# EAGLE design Domino I2S (EAGLE 6.5.0)
DATABASE: ./../Common/BOM/Domino_DB.txt; DRAWN: M.STEMPIN; REV: B
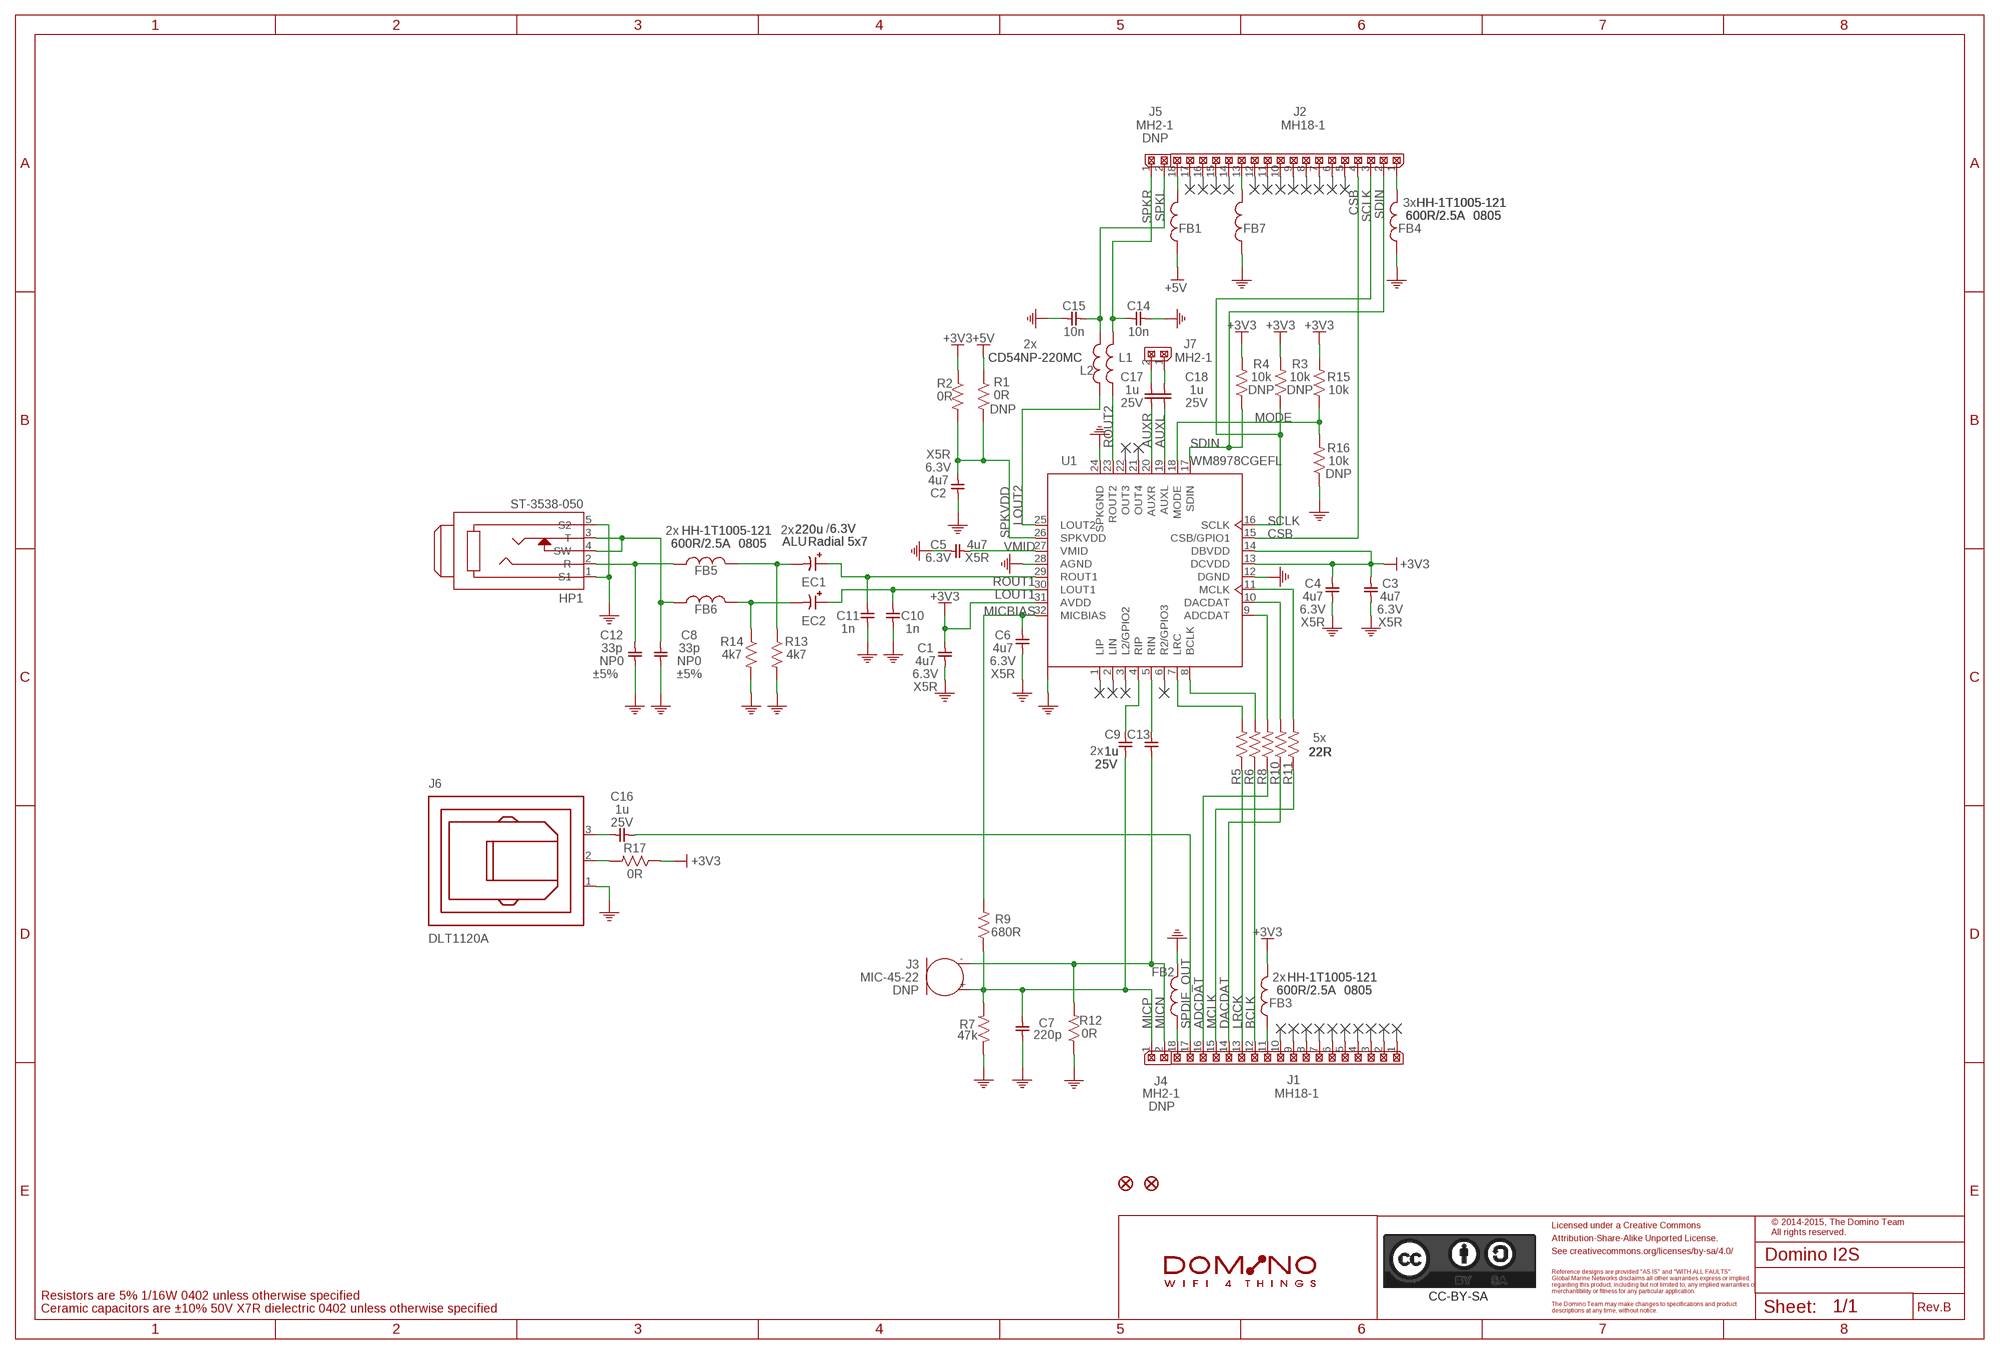
[diagram p0: schematic, sheet 1]
PORT1 (NC): BOM: EXCLUDE
PORT2 (NC): BOM: EXCLUDE
PORT3 (NC): BOM: EXCLUDE
PORT4 (NC): BOM: EXCLUDE
PORT5 (NC): BOM: EXCLUDE
PORT6 (NC): BOM: EXCLUDE
PORT7 (NC): BOM: EXCLUDE
PORT8 (NC): BOM: EXCLUDE
PORT9 (NC): BOM: EXCLUDE
PORT10 (NC): BOM: EXCLUDE
PORT11 (NC): BOM: EXCLUDE
PORT12 (NC): BOM: EXCLUDE
PORT13 (NC): BOM: EXCLUDE
PORT14 (NC): BOM: EXCLUDE
PORT15 (NC): BOM: EXCLUDE
PORT16 (NC): BOM: EXCLUDE
PORT17 (NC): BOM: EXCLUDE
PORT18 (NC): BOM: EXCLUDE
PORT19 (NC): BOM: EXCLUDE
PORT22 (NC): BOM: EXCLUDE
PORT23 (NC): BOM: EXCLUDE
PORT24 (NC): BOM: EXCLUDE
PORT25 (NC): BOM: EXCLUDE
PORT26 (NC): BOM: EXCLUDE
PORT27 (NC): BOM: EXCLUDE
PORT28 (NC): BOM: EXCLUDE
PORT29 (NC): BOM: EXCLUDE
PORT30 (NC): BOM: EXCLUDE

## Parts
C1  4u7  CAP_0402  [C0402]
C2  4u7  CAP_0402  [C0402]
C3  4u7  CAP_0402  [C0402]
C4  4u7  CAP_0402  [C0402]
C5  4u7  CAP_0402  [C0402]
C6  4u7  CAP_0402  [C0402]
C7  220p  CAP_0402  [C0402]
C8  33p  CAP_0402  [C0402]
C9  1u  CAP_0402  [C0402]
C10  1n  CAP_0402  [C0402]
C11  1n  CAP_0402  [C0402]
C12  33p  CAP_0402  [C0402]
C13  1u  CAP_0402  [C0402]
C14  10n  CAP_0402  [C0402]
C15  10n  CAP_0402  [C0402]
C16  1u  CAP_0402  [C0402]
C17  1u  CAP_0402  [C0402]
C18  1u  CAP_0402  [C0402]
CC-BY-SA101  CC-BY-SA_LOGO  [CC-BY-SA_LOGO]
EC1  220u  CPOL_E2-5X7  [E2-5]
EC2  220u  CPOL_E2-5X7  [E2-5]
F1  FIDUCIAL  [FIDUCIAL]
F2  FIDUCIAL  [FIDUCIAL]
FB1  HH-1T1005-121  FB_0805  [FB0805]
FB2  HH-1T1005-121  FB_0805  [FB0805]
FB3  HH-1T1005-121  FB_0805  [FB0805]
FB4  HH-1T1005-121  FB_0805  [FB0805]
FB5  HH-1T1005-121  FB_0805  [FB0805]
FB6  HH-1T1005-121  FB_0805  [FB0805]
FB7  HH-1T1005-121  FB_0805  [FB0805]
HP1  ST-3538-050  [ST-3538-050]
J1  MH18-1  [MH18-1-0.1]
J2  MH18-1  [MH18-1-0.1]
J3  MIC-45-22  [MIC-45-22]
J4  MH2-1  [MH2-1-0.1]
J5  MH2-1  [MH2-1-0.1]
J6  DLT1120A  [DLT1120A]
J7  MH2-1  [MH2-1-0.1]
L1  CD54NP-220MC  [CD54]
L2  CD54NP-220MC  [CD54]
R1  0R  RES_0402  [R0402]
R2  0R  RES_0402  [R0402]
R3  10k  RES_0402  [R0402]
R4  10k  RES_0402  [R0402]
R5  22R  RES_0402  [R0402]
R6  22R  RES_0402  [R0402]
R7  47k  RES_0402  [R0402]
R8  22R  RES_0402  [R0402]
R9  680R  RES_0402  [R0402]
R10  22R  RES_0402  [R0402]
R11  22R  RES_0402  [R0402]
R12  0R  RES_0402  [R0402]
R13  4k7  RES_0402  [R0402]
R14  4k7  RES_0402  [R0402]
R15  10k  RES_0402  [R0402]
R16  10k  RES_0402  [R0402]
R17  0R  RES_0402  [R0402]
S101  DOMINO_LOGO  [DOMINO_LOGO]
U1  WM8978CGEFL  [QFN-32_EP_5X5]

## Nets
+3V3: C1.1 C3.1 C4.1 FB3.2 R2.1 R3.2 R4.2 R15.2 R17.1 U1.13(DCVDD) U1.14(DBVDD) U1.31(AVDD)
+5V: FB1.1 R1.1
ADCDAT: J1.16 R8.1
AUXL: C18.2 U1.19(AUXL)
AUXR: C17.2 U1.20(AUXR)
BCLK: J1.12 R6.1
CSB: J2.4 U1.15(CSB/GPIO1)
DACDAT: J1.14 R10.1
GND: C1.2 C2.1 C3.2 C4.2 C5.1 C6.2 C7.2 C8.1 C10.2 C11.2 C12.1 C14.2 C15.2 FB2.2 FB4.1 FB7.1 HP1.1(S1) HP1.5(S2) J6.1(GND) R7.1 R12.1 R13.2 R14.2 R16.1 U1.12(DGND) U1.24(SPKGND) U1.28(AGND) U1.PAD
LOUT1: C10.1 EC2.1(+) U1.30(LOUT1)
LOUT2: L2.1 U1.25(LOUT2)
LRCK: J1.13 R5.1
MCLK: J1.15 R11.1
MICBIAS: C6.1 R9.2 U1.32(MICBIAS)
MICN: C13.2 J3.- J4.2 R12.2
MICP: C7.1 C9.2 J3.+ J4.1 R7.2 R9.1
MODE: R15.1 R16.2 U1.18(MODE)
N$1: R5.2 U1.7(LRC)
N$2: R6.2 U1.8(BCLK)
N$3: R8.2 U1.9(ADCDAT)
N$4: R10.2 U1.10(DACDAT)
N$5: R11.2 U1.11(MCLK)
N$6: C9.1 U1.4(RIP)
N$7: C13.1 U1.5(RIN)
N$8: C16.1 J6.3(VIN)
N$9: J6.2(VCC) R17.2
N$10: FB2.1 J1.18
N$11: FB1.2 J2.18
N$12: EC1.2(-) FB5.2 R13.1
N$13: EC2.2(-) FB6.2 R14.1
N$14: FB3.1 J1.11
N$15: FB7.2 J2.13
N$16: C8.2 FB6.1 HP1.3(T) HP1.4(SW)
N$17: C12.2 FB5.1 HP1.2(R)
N$18: FB4.2 J2.1
N$19: C17.1 J7.2
N$20: C18.1 J7.1
ROUT1: C11.1 EC1.1(+) U1.29(ROUT1)
ROUT2: L1.1 U1.23(ROUT2)
SCLK: J2.3 R3.1 U1.16(SCLK)
SDIN: J2.2 R4.1 U1.17(SDIN)
SPDIF_OUT: C16.2 J1.17
SPKL: C15.1 J5.2 L2.2
SPKR: C14.1 J5.1 L1.2
SPKVDD: C2.2 R1.2 R2.2 U1.26(SPKVDD)
VMID: C5.2 U1.27(VMID)
Unconnected: J1.1 J1.2 J1.3 J1.4 J1.5 J1.6 J1.7 J1.8 J1.9 J1.10 J2.5 J2.6 J2.7 J2.8 J2.9 J2.10 J2.11 J2.12 J2.14 J2.15 J2.16 J2.17 U1.1(LIP) U1.2(LIN) U1.3(L2/GPIO2) U1.6(R2/GPIO3) U1.21(OUT4) U1.22(OUT3)

## Notes on the sheet
- 3x
- 2x
- 2x | /
- 2x
- 5x
- 2x
- 2x
- Licensed under a Creative Commons
- © 2014-2015, The Domino Team
  All rights reserved.
- Attribution-Share-Alike Unported License.
- See creativecommons.org/licenses/by-sa/4.0/
- Reference designs are provided "AS IS" and "WITH ALL FAULTS".
- Global Marine Networks disclaims all other warranties express or implied,
- regarding this product, including but not limited to, any implied warranties of
- merchantibility or fitness for any particular application.
- Resistors are 5% 1/16W 0402 unless otherwise specified
- The Domino Team may make changes to specifications and product
- Ceramic capacitors are ±10% 50V X7R dielectric 0402 unless otherwise specified | descriptions at any time, without notice. | Rev.

## Library data of the parts
C1-C6 = Domino:CAP_: Capacitor; PARTNO: C0402_4u7_X5R_10%_CER_6V3; SIZE: 0402; TC: X5R; TOL: ±10%; TYPE: CER; VOLT: 6.3V
C7 = Domino:CAP_: Capacitor; PARTNO: C0402_220p_X7R_10%_CER_50V; SIZE: 0402; TC: X7R; TOL: ±10%; TYPE: CER; VOLT: 50V
C8 C12 = Domino:CAP_: Capacitor; PARTNO: C0402_33p_NP0_5%_CER_50V; SIZE: 0402; TC: NP0; TOL: ±5%; TYPE: CER; VOLT: 50V
C9 C13 C16-C18 = Domino:CAP_: Capacitor; PARTNO: C0402_1u_X7R_10%_CER_25V; SIZE: 0402; TC: X7R; TOL: ±10%; TYPE: CER; VOLT: 25V
C10 C11 = Domino:CAP_: Capacitor; PARTNO: C0402_1n_X7R_10%_CER_50V; SIZE: 0402; TC: X7R; TOL: ±10%; TYPE: CER; VOLT: 50V
C14 C15 = Domino:CAP_: Capacitor; PARTNO: C0402_10n_X7R_10%_CER_50V; SIZE: 0402; TC: X7R; TOL: ±10%; TYPE: CER; VOLT: 50V
CC-BY-SA101 = Domino:CC-BY-SA_LOGO: Attribution-Share-Alike Unported License See creativecommons.org/licenses/by-sa/3.0/ for details.; BOM: EXCLUDE
EC1 EC2 = Domino:CPOL_?*: Polarized Capacitor; PARTNO: C2-5x7_220u_ALU_20%_RAD_6V3; SIZE: Radial 5x7; TOL: ±20%; TYPE: ALU; VOLT: 6.3V
F1 F2 = Domino:FIDUCIAL: Fiducial Mark; BOM: EXCLUDE
FB1-FB7 = Domino:FB_: Ferrite Bead; OPT: 600R/2.5A; PARTNO: HH-1T2012-601; SIZE: 0805
HP1 = Domino:ST-3538-050: TRS Phone Jack, 1 Switch; PARTNO: ST-3538-050
J1 J2 = Domino:MH18-1: 18x1 Pin Male Header; PARTNO: MH18-1-0.1
J3 = Domino:MIC-45-22: Electret Microphone Diameter 45 mm; DNP: T; PARTNO: MIC-45-22
J4 J5 = Domino:MH2-1: 2x1 Pin Male Header; DNP: T; PARTNO: MH2-1-0.1
J6 = Domino:DLT1120A: SPDIF Fiber Optic Data Link Socket; PARTNO: DLT1120A
J7 = Domino:MH2-1: 2x1 Pin Male Header; PARTNO: MH2-1-0.1
L1 L2 = Domino:CD54NP-*MC: SMD Power Inductor; PARTNO: CD54NP-220MC
R1 = Domino:RES_: Resistor; DNP: T; PARTNO: R0402_0R_5%_62.5mW; RATE: 62.5mW; SIZE: 0402; TOL: 5%
R2 R12 R17 = Domino:RES_: Resistor; PARTNO: R0402_0R_5%_62.5mW; RATE: 62.5mW; SIZE: 0402; TOL: 5%
R3 R4 R16 = Domino:RES_: Resistor; DNP: T; PARTNO: R0402_10k_5%_62.5mW; RATE: 62.5mW; SIZE: 0402; TOL: 5%
R5 R6 R8 R10 R11 = Domino:RES_: Resistor; PARTNO: R0402_22R_5%_62.5mW; RATE: 62.5mW; SIZE: 0402; TOL: 5%
R7 = Domino:RES_: Resistor; PARTNO: R0402_47k_5%_62.5mW; RATE: 62.5mW; SIZE: 0402; TOL: 5%
R9 = Domino:RES_: Resistor; PARTNO: R0402_680R_5%_62.5mW; RATE: 62.5mW; SIZE: 0402; TOL: 5%
R13 R14 = Domino:RES_: Resistor; PARTNO: R0402_4k7_5%_62.5mW; RATE: 62.5mW; SIZE: 0402; TOL: 5%
R15 = Domino:RES_: Resistor; PARTNO: R0402_10k_5%_62.5mW; RATE: 62.5mW; SIZE: 0402; TOL: 5%
S101 = Domino:DOMINO_LOGO: Domino Logo; BOM: EXCLUDE
U1 = Domino:WM8978: Stereo CODEC with Speaker Driver; PARTNO: WM8978CGEFL

## Net classes
1 USB: width 0.368 mm, clearance 0.152 mm to class 0, clearance 0.152 mm

## Board
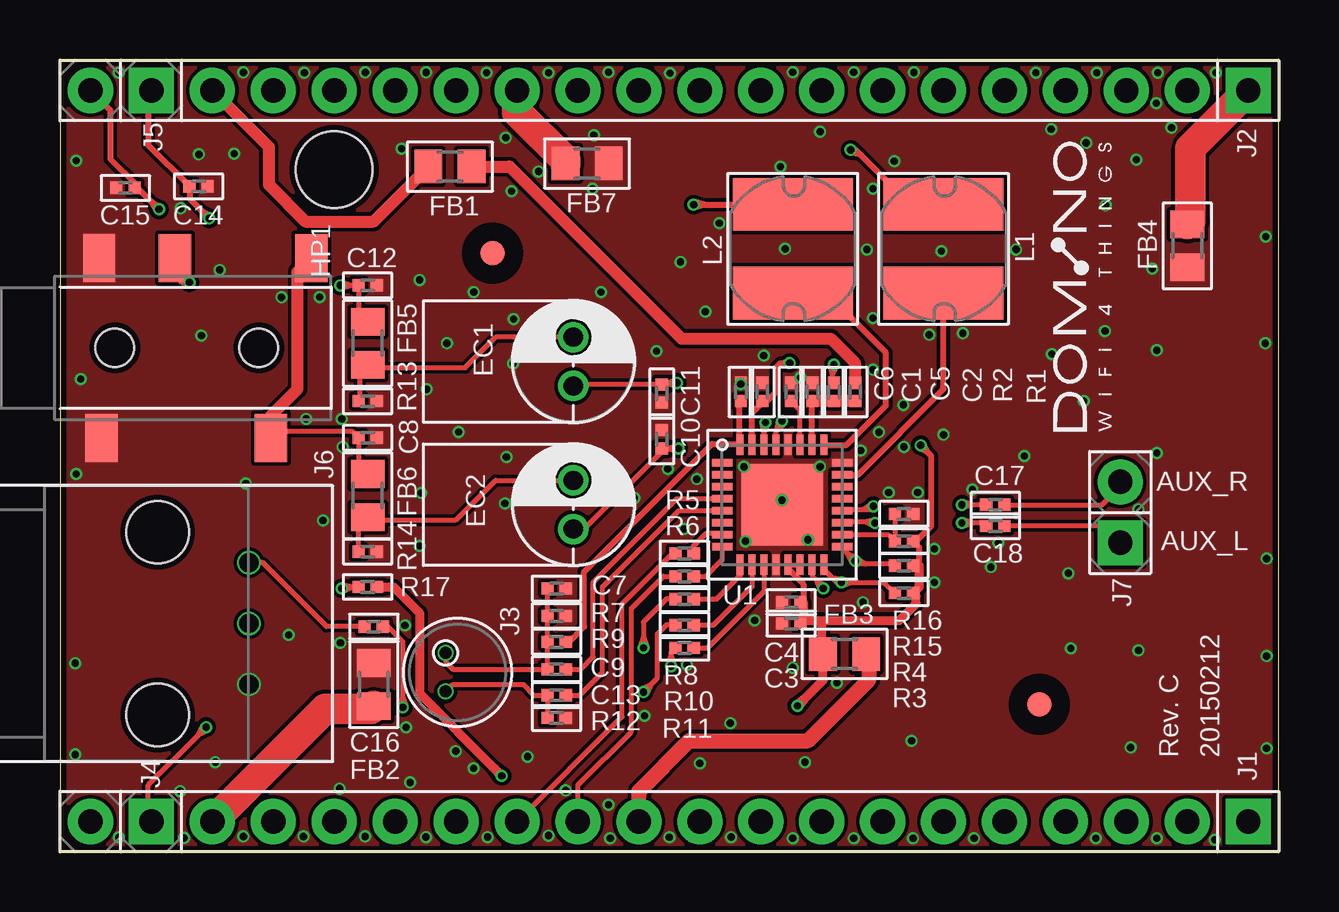
[diagram p1: board, top side]
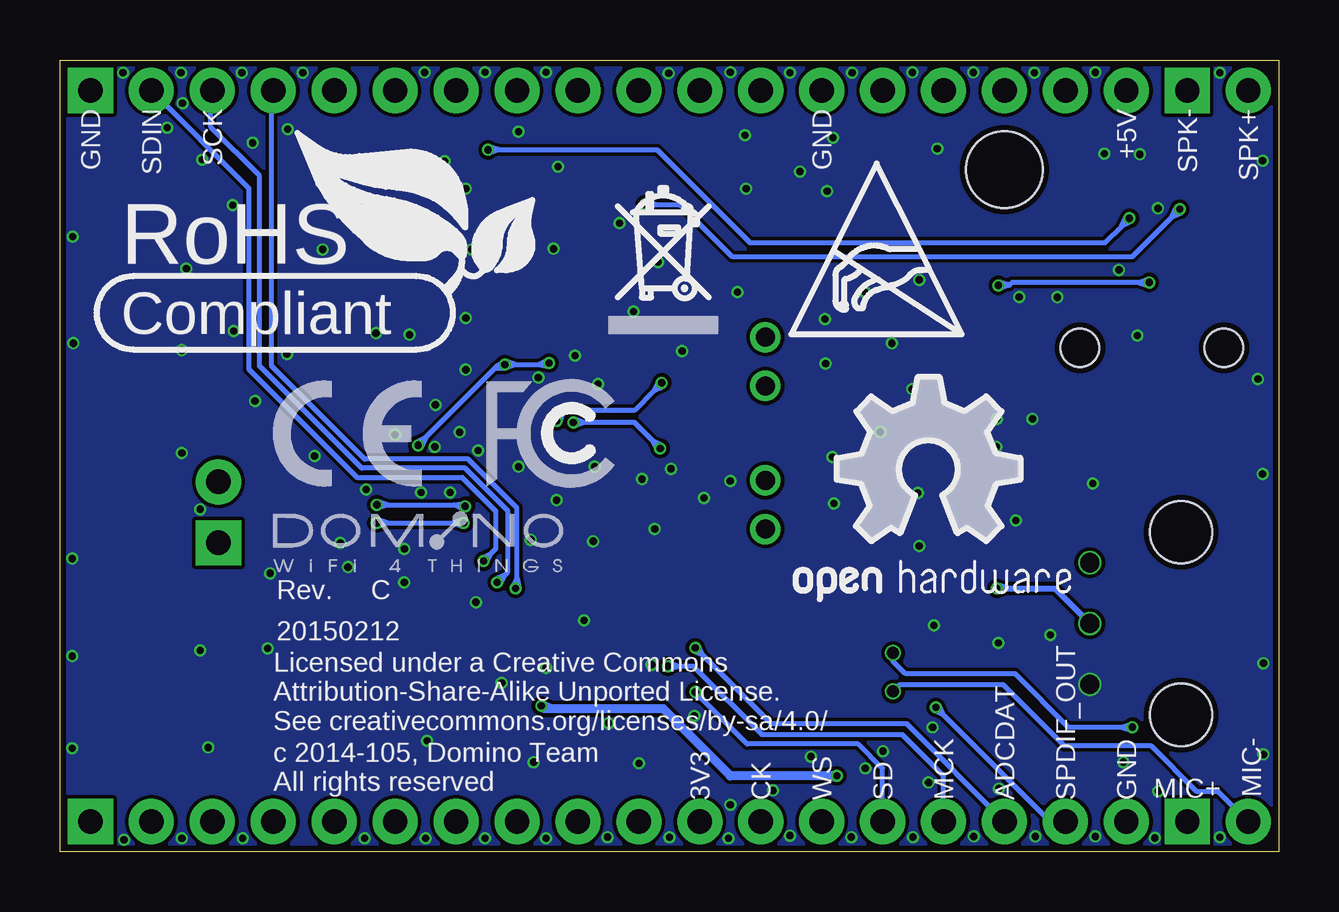
[diagram p2: board, bottom side, seen from below]

Size 50.8 x 33.02 mm. Coordinates in mm from the lower left corner, seen from the top.
Outline: 50.8,0 50.8,33.02 0,33.02 0,0 50.8,0
Copper layers (1*16): Top 0.043mm / dielectric 1mm / Bottom 0.043mm
Design rules "Domino *": minimum track width 0.1mm, minimum drill 0.3mm, track to track 6mil, track to pad 6mil, pad to pad 6mil, via to via 6mil, smd to smd 0mil, copper to edge 0.25mm, drill to drill 0.35mm, minimum pad ring 0.085mm, minimum via ring 0.1mm, stop-mask expansion 0mil, vias tented up to drill 0.45mm, thermal gap 0.2mm
Holes 3.2 mm at 11.43,28.45

### Footprints (pad centres in the part's own frame; a part is rotated, then mirrored left to right if it is on the bottom)
C0402 = smd 0.508 x 0.508: 1 -0.381,0; 2 0.381,0
E2-5 = drill 0.8 pad 1.27: 1 -1.016,0; 2 1.016,0
FIDUCIAL = smd 1.016 x 1.016: 1 0,0
FB0805 = smd 1.15 x 1.4: 1 -0.9,0; 2 0.9,0
ST-3538-050 = smd 1.35 x 2: 1 -0.55,-3.75; 2 2.5,3.75; 3 6.5,-3.75; 4 8.2,3.75; 5 -0.65,3.75 | hole 1.6: 0,0; 6,0
MH18-1-0.1 = drill 1.016 pad 1.88 square: 1 0,0 | drill 1.016 pad 1.88: 2 2.54,0; 3 5.08,0; 4 7.62,0; 5 10.16,0; 6 12.7,0; 7 15.24,0; 8 17.78,0; 9 20.32,0; 10 22.86,0; 11 25.4,0; 12 27.94,0; 13 30.48,0; 14 33.02,0; 15 35.56,0; 16 38.1,0; 17 40.64,0; 18 43.18,0
MIC-45-22 = drill 0.5 pad 0.65: + 0.8,0.5; - -0.8,0.5
MH2-1-0.1 = drill 1.016 pad 1.88 square: 1 0,0 | drill 1.016 pad 1.88: 2 2.54,0
DLT1120A = drill 0.8: 1 -2.54,0; 2 0,0; 3 2.54,0 | hole 2.6: -3.81,3.8; 3.81,3.8
CD54 = smd 2.2 x 5: 1 -1.85,0; 2 1.85,0
R0402 = smd 0.508 x 0.508: 1 -0.381,0; 2 0.381,0
QFN-32_EP_5X5 = smd 0.85 x 0.3: 1 -2.5,1.75; 2 -2.5,1.25; 3 -2.5,0.75; 4 -2.5,0.25; 5 -2.5,-0.25; 6 -2.5,-0.75; 7 -2.5,-1.25; 8 -2.5,-1.75; 17 2.5,-1.75; 18 2.5,-1.25; 19 2.5,-0.75; 20 2.5,-0.25; 21 2.5,0.25; 22 2.5,0.75; 23 2.5,1.25; 24 2.5,1.75 | smd 0.3 x 0.85: 9 -1.75,-2.5; 10 -1.25,-2.5; 11 -0.75,-2.5; 12 -0.25,-2.5; 13 0.25,-2.5; 14 0.75,-2.5; 15 1.25,-2.5; 16 1.75,-2.5; 25 1.75,2.5; 26 1.25,2.5; 27 0.75,2.5; 28 0.25,2.5; 29 -0.25,2.5; 30 -0.75,2.5; 31 -1.25,2.5; 32 -1.75,2.5 | smd 3.4 x 3.4: PAD 0,0

### Placement (x,y rotation side)
C1  29.27,19.18 90 top
C2  31.37,19.18 270 top
C3  30.48,9.53 180 top
C4  30.48,10.41 180 top
C5  30.48,19.18 270 top
C6  28.38,19.18 90 top
C7  20.7,10.99 0 top
C8  12.83,17.27 180 top
C9  20.7,7.62 180 top
C10  25.08,17.21 90 top
C11  25.08,19.11 270 top
C12  12.83,23.62 180 top
C13  20.7,6.54 180 top
C14  5.78,27.75 0 top
C15  2.73,27.69 180 top
C16  13.08,9.4 0 top
C17  38.99,14.48 180 top
C18  38.99,13.59 180 top
CC-BY-SA101  -5.08,-50.8 0 top  (outside the outline)
DRILEGEND  [DRILEGEND]  81.53,59.94 0 top  (outside the outline)
EC1  21.4,20.45 90 top
EC2  21.4,14.48 90 top
F1  40.83,6.16 90 top
F2  18.03,24.97 90 top
FB1  16.26,28.57 180 top
FB2  13.08,6.99 90 top
FB3  32.7,8.26 180 top
FB4  46.99,25.27 90 top
FB5  12.83,21.21 270 top
FB6  12.83,14.86 270 top
FB7  21.97,28.7 180 top
HP1  2.29,21.02 0 top
J1  49.53,1.27 180 top
J2  49.53,31.75 180 top
J3  16.57,7.49 90 top
J4  3.81,1.27 180 top
J5  3.81,31.75 180 top
J6  7.87,9.53 90 top
J7  44.2,12.89 90 top
L1  36.83,25.15 90 top
L2  30.54,25.15 90 top
R1  33.15,19.18 270 top
R2  32.26,19.18 270 top
R3  35.18,10.79 0 top
R4  35.18,11.94 0 top
R5  26.04,12.45 0 top
R6  26.04,11.49 0 top
R7  20.7,9.84 180 top
R8  26.04,10.54 0 top
R9  20.7,8.76 0 top
R10  26.04,9.46 0 top
R11  26.04,8.51 0 top
R12  20.7,5.59 180 top
R13  12.83,18.8 0 top
R14  12.83,12.52 0 top
R15  35.18,12.95 0 top
R16  35.18,14.1 180 top
R17  12.83,11.05 180 top
S101  -45.72,-48.26 0 top  (outside the outline)
U1  30.1,14.48 0 top
U$3  [A5L-LOC]  -55.88,-62.23 0 top  (outside the outline)
U$12  [DOMINO_LOGO_SMALL]  42.8,17.53 90 top
U$13  [RECYCLE_BIN_LOGO]  27.94,21.59 0 bottom
U$14  [DOMINO_LOGO_SMALL]  41.91,12.7 0 bottom
U$15  [ESD_LOGO]  20.32,21.59 0 bottom
U$16  [OPEN_HARDWARE_LOGO]  14.61,15.88 0 bottom
U$20  [CE_LOGO_SMALL]  41.91,15.24 0 bottom
U$21  [FCC_LOGO_SMALL]  33.02,15.24 0 bottom
U$22  [ROHS_LOGO]  48.26,21.59 0 bottom

### Tracks (layer width: path | path; a pad name or v marks a point on that pad's centre or on a via)
+3V3  (via drill 0.3)
  Top 0.203: R2.1 32.19,19.62 32.19,19.88 | 32.19,19.88 32.19,20.26 v32.26,20.32 | U1.13 U1.14 | 32.19,19.88 32.39,20.25 v32.26,20.32 | 32.19,19.88 32.11,20.29 v32.26,20.32
  Top 0.254: U1.13 30.35,11.81 30.99,11.18 30.99,10.54 C4.1 | U1.31 28.85,18.31 29.27,18.73 C1.1 29.46,18.8 29.84,19.18 29.84,20.19 29.97,20.32 | 29.97,20.32 30.04,20.38 v30.42,20.38 | 36.2,16.64 36.32,16.51 36.32,13.59 35.69,12.95 R15.2 35.81,12.7 35.81,12.19 R4.2 | 36.2,16.64 v35.88,16.95 | 29.97,20.32 30.4,20.26 v30.42,20.38 | 29.97,20.32 30.37,20.5 v30.42,20.38 | 36.2,16.64 35.98,17.01 v35.88,16.95 | 36.2,16.64 35.82,16.85 v35.88,16.95
  Top 0.381: R17.1 13.91,11.05 14.99,9.97 14.99,6.6 18.1,3.49 | 18.1,3.49 v18.41,3.17 | C4.1 30.99,10.41 30.99,9.65 | 30.99,9.65 C3.1 30.86,9.65 30.99,9.65 | 31.05,6.41 31.8,7.17 FB3.2 31.75,8.31 31.75,9.65 | 31.05,6.41 v30.73,6.1 | 30.99,9.65 31.75,9.65 | 31.75,9.65 34.99,9.65 35.69,10.35 35.69,10.67 R3.2 35.81,11.05 35.81,11.94 R4.2 | 18.1,3.49 18.37,3.14 v18.41,3.17 | 18.1,3.49 18.45,3.22 v18.41,3.17 | 31.05,6.41 30.7,6.14 v30.73,6.1 | 31.05,6.41 30.78,6.06 v30.73,6.1
  Bottom 0.203: v32.26,20.32 31.81,20.32 | 31.81,20.32 30.86,20.32 | 30.86,20.32 30.48,20.32 v30.42,20.38 | v35.88,16.95 35.56,17.27 | 35.56,17.27 32.68,20.16 | 32.68,20.16 32.51,20.32 v32.26,20.32 | 31.81,20.32 32.21,20.18 v32.26,20.32 | 31.81,20.32 32.21,20.46 v32.26,20.32 | 32.68,20.16 32.35,20.43 v32.26,20.32 | 32.68,20.16 32.25,20.17 v32.26,20.32 | 30.86,20.32 30.48,20.52 v30.42,20.38 | 30.86,20.32 30.45,20.24 v30.42,20.38 | 35.56,17.27 35.74,16.89 v35.88,16.95 | 35.56,17.27 35.94,17.09 v35.88,16.95
  Bottom 0.381: v18.41,3.17 18.86,3.17 | 18.86,3.17 22.86,3.17 25.65,5.97 30.3,5.97 | 30.3,5.97 30.61,5.97 v30.73,6.1 | 18.86,3.17 18.42,3.23 v18.41,3.17 | 18.86,3.17 18.42,3.12 v18.41,3.17 | 30.3,5.97 30.74,6.04 v30.73,6.1 | 30.3,5.97 30.71,6.15 v30.73,6.1
+5V
  Top 0.508: FB1.1 18.73,28.57 25.91,21.4 32.13,21.4 33.15,20.38 R1.1
ADCDAT  (via drill 0.3)
  Top 0.203: R8.1 25.27,10.54 24.32,9.59 24.32,8.96 | 24.32,8.96 v24.32,8.51 | 24.32,8.96 24.18,8.56 v24.32,8.51 | 24.32,8.96 24.46,8.56 v24.32,8.51
  Bottom 0.203: J1.16 15.49,5.33 21.14,5.33 24,8.19 | v24.32,8.51 24,8.19 | 24,8.19 24.39,8.38 v24.32,8.51 | 24,8.19 24.19,8.57 v24.32,8.51
AUXL  (via drill 0.3)
  Top 0.203: 33.53,13.78 32.65,13.78 U1.19 | 33.53,13.78 33.91,13.78 v33.97,13.72 | C18.2 38.48,13.72 38.04,13.72 | 38.04,13.72 v37.59,13.72 | 33.53,13.78 33.9,13.58 v33.97,13.72 | 33.53,13.78 33.94,13.86 v33.97,13.72 | 38.04,13.72 37.64,13.86 v37.59,13.72 | 38.04,13.72 37.64,13.58 v37.59,13.72
  Bottom 0.203: v37.59,13.72 37.14,13.72 | 37.14,13.72 34.42,13.72 | 34.42,13.72 v33.97,13.72 | 34.42,13.72 34.02,13.86 v33.97,13.72 | 34.42,13.72 34.02,13.58 v33.97,13.72 | 37.14,13.72 37.54,13.58 v37.59,13.72 | 37.14,13.72 37.54,13.86 v37.59,13.72
AUXR  (via drill 0.3)
  Top 0.203: v33.91,14.41 33.78,14.29 33.48,14.29 | C17.2 38.04,14.48 | 38.04,14.48 v37.59,14.48 | U1.20 32.66,14.29 33.48,14.29 | 33.48,14.29 33.9,14.27 v33.91,14.41 | 33.48,14.29 33.82,14.54 v33.91,14.41 | 38.04,14.48 37.64,14.62 v37.59,14.48 | 38.04,14.48 37.64,14.34 v37.59,14.48
  Bottom 0.203: v37.59,14.48 37.14,14.48 | 37.14,14.48 34.35,14.48 | 34.35,14.48 33.97,14.48 v33.91,14.41 | 34.35,14.48 33.94,14.56 v33.91,14.41 | 34.35,14.48 33.98,14.28 v33.91,14.41 | 37.14,14.48 37.54,14.34 v37.59,14.48 | 37.14,14.48 37.54,14.62 v37.59,14.48
BCLK
  Top 0.203: J1.12 21.59,2.79 23.81,5.02 23.81,10.16 25.15,11.49 R6.1
CSB  (via drill 0.3)
  Top 0.203: U1.15 31.35,11.51 31.53,11.33 | 31.53,11.33 31.81,11.05 v31.81,10.99 | 31.53,11.33 31.67,10.94 v31.81,10.99 | 31.53,11.33 31.89,11.11 v31.81,10.99
  Bottom 0.203: v31.81,10.99 31.75,11.05 31.75,11.43 | 31.75,11.43 31.75,14.35 33.78,16.38 38.1,16.38 41.97,20.26 41.97,31.69 J2.4 | 31.75,11.43 31.67,11.01 v31.81,10.99 | 31.75,11.43 31.95,11.05 v31.81,10.99
DACDAT  (via drill 0.3)
  Top 0.203: R10.1 25.27,9.46 24.89,9.08 24.89,7.24 24.64,6.99 | 24.64,6.99 v24.32,6.67 | 24.64,6.99 24.26,6.8 v24.32,6.67 | 24.64,6.99 24.45,6.6 v24.32,6.67
  Bottom 0.203: 24,6.35 22.16,4.51 17.53,4.51 16.51,3.49 J1.14 | 24,6.35 v24.32,6.67 | 24,6.35 24.39,6.53 v24.32,6.67 | 24,6.35 24.19,6.73 v24.32,6.67
GND  (via drill 0.3)
  other vias: 33.08,0.57 30.54,0.57 27.98,0.62 25.4,0.61 22.94,0.57 22.86,1.97 21.08,2.57 20.37,0.69 17.82,0.62 15.25,0.62 12.71,0.65 11.66,2.64 14.59,2.9 16.5,4.2 17.23,3.49 14.43,5.19 19.49,3.98 24.36,5.68 26.67,3.7 27.94,5.37 31.05,3.75 30.54,7.68 32.38,7.05 33.46,10.41 28.96,9.65 26.14,7.81 26.01,13.46 30.1,14.67 26.54,15.54 25.34,15.98 23.95,14.76 22.86,15.47 18.54,14.53 18.61,16.47 15.05,14.97 14.99,12.76 14.38,9.45 11.68,8.71 10.96,13.82 11.77,16.89 11.75,18.05 15.28,19.29 16.61,17.51 18.88,20.36 18.91,22.21 16.13,21.21 17.25,23.34 14.99,23.85 14.24,29.32 18.82,27.55 22.56,23.34 24.87,20.88 25.87,24.6 26.9,22.53 28.37,19.51 29.34,20.7 27.48,26.21 30.23,25.15 30.04,28.57 31.69,30.04 33.08,32.51 30.54,32.51 25.43,32.47 22.25,29.88 22.2,27.66 19.95,28.37 18.58,29.78 17.78,32.49 20.37,32.49 22.86,32.51 15.27,32.5 12.73,32.5 30.86,19.79 9.53,9.06 6.48,3.75 10.15,0.65 7.65,0.65 5.17,0.58 2.45,0.61 5.02,2.54 7.75,15.37 10.26,18.06 10.82,23.14 9.23,23.13 5.89,21.53 6.65,24.27 5.79,29.08 7.26,29.11 7.65,32.5 10.19,32.49 2.45,32.49 0.67,28.82 0.86,19.72 0.67,15.76 0.64,7.87 0.64,4.06 35.5,4.64 35.56,0.57 38.1,0.57 43.18,0.57 45.72,0.57 44.63,4.36 42.14,8.48 44.96,8.41 50.29,8.17 50.29,4.32 50.29,12.23 50.24,21.21 50.27,25.65 45.72,20.92 43.56,21.72 45.72,16.64 44.96,14.29 42.04,11.62 36.83,17.4 35.18,16.89 34.54,14.99 35.75,14.99 36.45,12.64 36.45,11.24 38.04,15.11 38.8,11.87 39.12,12.89 40.2,16.51 42.67,18.8 41.34,20.76 45.53,24.32 39.85,25.12 37.63,21.63 36.23,21.56 35.15,18.64 34.14,17.5 33.38,16.74 36.74,25.06 33.63,25.12 33.88,22.26 33.88,27.66 34.77,28.8 35.6,32.5 40.68,32.49 43.22,32.49 45.76,32.49 48.17,32.49 46.33,30.2 45.69,31.22 44.87,28.87 43.6,26.96 42.77,29.57 41.31,30.14 33.88,20.1 5.03,26.84 28.57,12.95 28.51,16.07 31.69,16.07 31.18,13.02 48.13,0.51
  pour Bottom (no thermals): 50.93,0 50.93,33.15 0,33.15 0,0
  pour Top (no thermals): 50.93,0 50.93,33.15 0,33.15 0,0
LOUT1  (via drill 0.3)
  Top 0.203: EC2.1 21.84,13.46 25.21,16.83 | 25.21,16.83 C10.1 | 25.21,16.83 25.33,16.83 | 25.33,16.83 v25.78,16.83 | U1.30 29.35,17.46 | 29.35,17.46 29.35,17.86 v29.4,17.91 | 25.33,16.83 25.73,16.69 v25.78,16.83 | 25.33,16.83 25.73,16.97 v25.78,16.83 | 29.35,17.46 29.53,17.84 v29.4,17.91 | 29.35,17.46 29.26,17.87 v29.4,17.91
  Bottom 0.203: v25.78,16.83 26.1,17.15 | 26.1,17.15 26.86,17.91 28.95,17.91 | 28.95,17.91 v29.4,17.91 | 26.1,17.15 25.72,16.96 v25.78,16.83 | 26.1,17.15 25.91,16.76 v25.78,16.83 | 28.95,17.91 29.35,17.77 v29.4,17.91 | 28.95,17.91 29.35,18.05 v29.4,17.91
LOUT2
  Top 0.254: U1.25 32.79,16.98 34.42,18.61 34.42,20.83 31.95,23.3 L2.1
LRCK
  Top 0.203: J1.13 23.43,5.65 23.43,10.35 25.53,12.45 R5.1
MCLK  (via drill 0.3)
  Top 0.203: R11.1 25.46,8.32 25.46,8.2 | 25.46,8.2 v25.46,7.75 | 25.46,8.2 25.32,7.8 v25.46,7.75 | 25.46,8.2 25.6,7.8 v25.46,7.75
  Bottom 0.203: J1.15 13.97,3.17 15.68,4.89 21.53,4.89 24.38,7.75 25.01,7.75 | 25.01,7.75 v25.46,7.75 | 25.01,7.75 25.41,7.61 v25.46,7.75 | 25.01,7.75 25.41,7.89 v25.46,7.75
MICBIAS
  Top 0.254: R9.2 21.21,8.76 21.84,9.4 21.84,11.68 27.18,17.02 28.31,17.02 U1.32 28.32,17.01 28.32,18.73 C6.1
MICN
  Top 0.203: J3.- 16.37,6.99 19.3,6.99 19.75,6.54 C13.2 R12.2
  Bottom 0.203: J3.- 15.78,6.99 11.49,6.99 8.95,4.45 5.33,4.45 3.43,2.54 2.54,2.54 J4.2
MICP  (via drill 0.3)
  Top 0.203: J3.+ 16.07,7.93 16.38,7.62 C9.2 R9.1 R7.2 C7.1 | J4.1 3.68,1.4 3.68,2.79 5.78,4.89 | 5.78,4.89 v6.1,5.21 | 5.78,4.89 6.16,5.07 v6.1,5.21 | 5.78,4.89 5.96,5.27 v6.1,5.21
  Bottom 0.203: v6.1,5.21 6.55,5.21 | 6.55,5.21 8.76,5.21 10.99,7.43 15.56,7.43 16.07,7.95 J3.+ | 6.55,5.21 6.14,5.35 v6.1,5.21 | 6.55,5.21 6.14,5.07 v6.1,5.21
MODE
  Top 0.203: R16.2 R15.1 34.54,13.21 32.62,13.21 U1.18
N$1
  Top 0.203: R5.2 26.42,12.76 26.92,13.27 27.55,13.27 U1.7
N$2
  Top 0.203: R6.2 26.92,11.49 27.6,12.17 U1.8
N$3
  Top 0.203: R8.2 27.37,10.54 28.35,11.52 U1.9
N$4
  Top 0.203: R10.2 27.24,9.46 28.85,11.07 U1.10
N$5
  Top 0.203: R11.2 26.99,8.51 29.35,10.87 U1.11
N$6
  Top 0.203: C9.1 21.72,7.62 22.23,8.13 22.23,11.24 25.72,14.73 U1.4
N$7
  Top 0.203: C13.1 21.65,6.54 22.61,7.49 22.61,11.05 25.79,14.23 U1.5
N$8
  Top 0.203: 12.83,9.53 C16.1 11.11,9.4 8.45,12.06 J6.3
N$9  (via drill 0.3)
  Top 0.203: R17.2 12.19,11.05 | 12.19,11.05 11.81,11.05 v11.75,10.99 | 12.19,11.05 11.78,11.13 v11.75,10.99 | 12.19,11.05 11.82,10.85 v11.75,10.99
  Bottom 0.254: v11.75,10.99 11.3,10.99 | 11.3,10.99 9.34,10.99 J6.2 | 11.3,10.99 11.71,10.87 v11.75,10.99 | 11.3,10.99 11.71,11.1 v11.75,10.99
N$10
  Top 1.27: J1.18 11.05,5.97 12.96,5.97 FB2.1
N$11
  Top 0.508: J2.18 8.7,29.4 8.7,27.81 10.22,26.29 13.08,26.29 FB1.2
N$12
  Top 0.203: EC1.2 18.16,21.46 16.89,20.19 12.94,20.19 FB5.2 12.51,19.99 12.51,18.73 R13.1
N$13
  Top 0.203: FB6.2 12.94,13.84 16.51,13.84 18.16,15.49 EC2.2 | 12.83,13.78 FB6.2 | R14.1 12.45,13.58 FB6.2
N$14
  Top 0.635: J1.11 24.13,2.54 26.23,4.64 31.18,4.64 33.72,7.18 33.72,8.14 FB3.1
N$15
  Top 1.27: J2.13 19.05,30.85 19.06,30.85 21.07,28.84 FB7.2
N$16
  Top 0.203: FB6.1 12.45,16.14 C8.2 12.19,17.53 9.04,17.53 HP1.3
  Top 0.508: HP1.3 8.79,18.18 9.91,19.3 9.91,24.19 HP1.4
N$17  (via drill 0.3)
  Top 0.203: FB5.1 12.45,22.49 C12.2 12.13,23.62 | 12.13,23.62 v11.68,23.62 | v5.4,23.75 5.08,23.75 4.96,23.87 | 4.96,23.87 4.79,24.04 HP1.2 | 12.13,23.62 11.73,23.76 v11.68,23.62 | 12.13,23.62 11.73,23.48 v11.68,23.62 | 4.96,23.87 5.31,23.63 v5.4,23.75 | 4.96,23.87 5.39,23.9 v5.4,23.75
  Bottom 0.203: v5.4,23.75 5.85,23.75 | 5.85,23.75 11.11,23.75 11.23,23.63 | 11.23,23.63 11.24,23.62 v11.68,23.62 | 11.23,23.63 11.63,23.48 v11.68,23.62 | 11.23,23.63 11.64,23.76 v11.68,23.62 | 5.85,23.75 5.45,23.89 v5.4,23.75 | 5.85,23.75 5.45,23.61 v5.4,23.75
N$18
  Top 1.27: J2.1 47.12,29.34 47.12,26.3 FB4.2
N$19
  Top 0.203: C17.1 43.43,14.48 44.2,15.24 J7.2
N$20
  Top 0.203: C18.1 43.5,13.59 J7.1
ROUT1  (via drill 0.3)
  Top 0.203: 25.27,19.56 25.15,19.56 C11.1 21.46,19.49 EC1.1 | 25.27,19.56 v25.72,19.56 | U1.29 29.85,17.53 29.89,17.57 | 29.89,17.57 30.1,17.78 v30.1,17.97 | 25.27,19.56 25.67,19.42 v25.72,19.56 | 25.27,19.56 25.67,19.7 v25.72,19.56 | 29.89,17.57 30.2,17.86 v30.1,17.97 | 29.89,17.57 29.95,17.99 v30.1,17.97
  Bottom 0.203: 29.85,18.35 29.78,18.41 26.86,18.41 26.04,19.24 | 29.85,18.35 30.1,18.1 v30.1,17.97 | v25.72,19.56 26.04,19.24 | 26.04,19.24 25.85,19.62 v25.72,19.56 | 26.04,19.24 25.65,19.42 v25.72,19.56 | 29.85,18.35 29.95,17.93 v30.1,17.97 | 29.85,18.35 30.19,18.09 v30.1,17.97
ROUT2
  Top 0.254: U1.23 33.25,15.73 36.83,19.3 L1.1
SCLK  (via drill 0.3)
  Top 0.203: U1.16 31.85,11.78 32.18,11.45 | 32.18,11.45 32.38,11.24 v32.58,11.24 | v32.58,11.24 33.03,11.24 | 33.03,11.24 34.35,11.24 R3.1 | 32.18,11.45 32.47,11.14 v32.58,11.24 | 32.18,11.45 32.6,11.39 v32.58,11.24 | 33.03,11.24 32.62,11.38 v32.58,11.24 | 33.03,11.24 32.62,11.1 v32.58,11.24
  Bottom 0.203: v32.58,11.24 32.26,11.56 | 32.26,11.56 32.13,11.68 32.13,14.22 33.91,16 38.23,16 42.48,20.26 42.48,28.19 44.51,30.23 44.51,31.69 J2.3 | 32.26,11.56 32.44,11.18 v32.58,11.24 | 32.26,11.56 32.64,11.37 v32.58,11.24
SDIN  (via drill 0.3)
  Top 0.203: R4.1 34.73,12 33.58,12 | 33.58,12 33.27,12 v33.15,12.13 | v33.15,12.13 33.15,12.12 32.82,12.44 | 32.82,12.44 32.6,12.66 U1.17 | 33.58,12 33.23,12.25 v33.15,12.13 | 33.58,12 33.15,11.98 v33.15,12.13 | 32.82,12.44 33.02,12.06 v33.15,12.13 | 32.82,12.44 33.21,12.26 v33.15,12.13
  Bottom 0.203: J2.2 42.93,27.69 42.93,20.13 38.42,15.62 34.04,15.62 32.64,14.22 32.64,12.64 32.83,12.45 | 32.83,12.45 v33.15,12.13 | 32.83,12.45 33.01,12.06 v33.15,12.13 | 32.83,12.45 33.21,12.26 v33.15,12.13
SPDIF_OUT  (via drill 0.3)
  Top 0.203: C16.2 13.65,9.4 14.29,8.76 14.29,6.48 | 14.29,6.48 v14.29,6.03 | 14.29,6.48 14.15,6.08 v14.29,6.03 | 14.29,6.48 14.43,6.08 v14.29,6.03
  Bottom 0.203: J1.17 9.53,1.27 13.97,5.71 | 13.97,5.71 v14.29,6.03 | 13.97,5.71 14.35,5.9 v14.29,6.03 | 13.97,5.71 14.15,6.1 v14.29,6.03
SPKL  (via drill 0.3)
  Top 0.254: v4.13,26.8 3.81,27.11 | 3.81,27.11 3.24,27.69 C15.1 3.11,27.88 2.1,28.89 2.1,30.92 J5.2 | v26.42,26.99 26.87,26.99 | 26.87,26.99 30.54,26.99 L2.2 | 26.87,26.99 26.45,27.11 v26.42,26.99 | 26.87,26.99 26.45,26.87 v26.42,26.99 | 3.81,27.11 4.02,26.74 v4.13,26.8 | 3.81,27.11 4.19,26.9 v4.13,26.8
  Bottom 0.203: v26.42,26.99 25.97,26.99 | 25.97,26.99 24.96,26.99 22.8,24.83 6.1,24.83 4.45,26.48 | 4.45,26.48 v4.13,26.8 | 25.97,26.99 26.37,26.85 v26.42,26.99 | 25.97,26.99 26.37,27.13 v26.42,26.99 | 4.45,26.48 4.26,26.86 v4.13,26.8 | 4.45,26.48 4.06,26.66 v4.13,26.8
SPKR  (via drill 0.3)
  Top 0.254: J5.1 3.68,31.62 3.68,29.46 C14.1 5.4,27.24 5.91,26.73 | 5.91,26.73 v6.22,26.42 | L1.2 35.42,27 33.35,29.07 | 33.35,29.07 33.15,29.27 v32.96,29.27 | 5.91,26.73 6.12,26.36 v6.22,26.42 | 5.91,26.73 6.28,26.52 v6.22,26.42 | 33.35,29.07 33.04,29.36 v32.96,29.27 | 33.35,29.07 32.93,29.15 v32.96,29.27
  Bottom 0.203: v32.96,29.27 32.51,29.27 | 32.51,29.27 25.91,29.27 22.04,25.4 7.24,25.4 6.54,26.1 | 6.54,26.1 v6.22,26.42 | 6.54,26.1 6.36,26.48 v6.22,26.42 | 6.54,26.1 6.16,26.28 v6.22,26.42 | 32.51,29.27 32.91,29.13 v32.96,29.27 | 32.51,29.27 32.91,29.41 v32.96,29.27
SPKVDD
  Top 0.203: R1.2 33.15,18.73
  Top 0.254: U1.26 31.35,18.8 C2.2
  Top 0.508: R1.2 R2.2 C2.2
VMID
  Top 0.203: U1.27 30.85,18.43 C5.2

### Text on the board
tNames: AUX_R | AUX_L | Rev.
bNames: SPK+ | SPK- | +5V | GND | SCK | SDIN | GND | Rev. | Licensed under a Creative Commons / Attribution-Share-Alike Unported License. / See creativecommons.org/licenses/by-sa/4.0/ | MIC+ | c 2014-105, Domino Team / All rights reserved | MIC- | GND | SPDIF_OUT | ADCDAT | MCK | SD | WS | CK | 3V3
Document: DRILL CHART: TOP TO BOTTOM | LINE WIDTH IMPEDANCE CHART FOR REFERENCE | Class | USB | Type | Diff Coated Coplanar Waveguide With Ground 1B | Layer | Impedance | Trace Width | Trace Separation | Ground Separation | TOP, / BOTTOM | 90 Ohms | 14.5 mils | 6 mils | 6 mils | STACK-UP FOR REFERENCE | LAYER 1 L1 TOP | 18 UM CU + 12.5 UM PLATING (30.5 UM) | 1.061 MM+/-10% | CORE | 1.0 MM CORE FR-4 LG 135 / INCLUDING COPPER | LAYER 4 L16 BOTTOM | 18 UM CU + 12.5 UM PLATING (30.5 UM) | NOTES: | 1. PRINTED CIRCUIT BOARD MADE FROM NEMA GRADE FR-4 TG 135 EPOXY / LAMINATE WITH 18 UM COPPER PLATING AND 1 MM THICKNESS. | 2. ALL DIMENSIONS ARE GIVEN IN MILLIMETERS EXCEPT TRACE WIDTH/SPACE. | 3. CIRCUIT PATHS ARE FOR REFERENCE ONLY. | 4. HOLE SIZES SHOWN ARE FINISHED DIAMETERS AFTER PLATING. | 5. BOARD PLATED USING REFLOW OR SIMILAR METHOD. | 6. BOARD TO HAVE WHITE SOLDER MASK ON PLATED SURFACES USING WET / FILM SR100 OR SR1010 EPOXY. / EQUIVALENT WET OR DRY FILM MAY BE USED. | 7. SILKSCREEN BOARD USING BLACK INK. DISTORTION OF SILKSCREEN / IS ACCEPTABLE OVER TRACES. EPOXY INK ON PLATED LANDS IS NOT / ACCEPTABLE | 8. THE FOLLOWING INFORMATION APPLIES TO THIS BOARD: | * 2 COPPER LAYERS | * 1 MM BOARD THICKNESS | * REQUIRES TOP AND BOTTOM SIDE SILKSCREENS | © 2014-2015, The Domino Team. / All rights reserved. | Licensed under a Creative Commons / Attribution-Share-Alike Unported License. / See creativecommons.org/licenses/by-sa/4.0/ | Reference designs are provided "AS IS" and "WITH ALL FAULTS". / The Domino Team disclaims all other warranties express or implied, / regarding this product, including but not limited to, any implied warranties of / merchantibility or fitness for any particular application. | The Domino Team may make changes to specifications and product descriptions / at any time, without notice. | Rev.
DrillLegend: LAYER-STACK
DrillLegend_01-16: 01-16
DrillLegend_01-20: 01-20
Pinout: SPKR | SPKL | +5V | SCLK | SDIN | GND | MICP | MICN | GND | SPDIF_OUT | I2S_MICIN | I2S_MCK | I2S_SD | I2S_WS | I2S_CK | +3V3 | Pinout (.PIN)
GeMiNi_Antenna: Component Side (.CMP)
GeMiNi_Antenna_Keepout: Solder side (.SOL)
GeMiNi_LEDs: Silk screen CMP (.PLC)
GeMiNi_Console: Silk screen SOL (.PLS)
GeMiNi_Measures: Solder stop mask CMP (.STC)
GeMiNi_Legend: Solder stop mask SOL (.STS)
206bmp: Cream frame CMP (.CRC)
207bmp: Cream frame SOL (.CRS)
208bmp: Drill data (.DRD)
209bmp: Component Assembly CMP (.ASC)
210bmp: Component Assembly SOL (.ASS)
211bmp: Outline (.OLN)